# Altium schematic sheet SysController.SchDoc
size 420 x 297 mm; Address1: Address1; Address2: Address2; Address3: Address3; Address4: Address4; DocumentNumber: 5; SheetNumber: 5; SheetTotal: 7; Scale: 1:1; Обозначение документа: АБВГ.123456.001 Э3; Разраб.: Иванов; Пров.: Петров; Утв.: Сидоров; Наименование организации: ОАО "Ваша фирма"; Перв. применение: АБВГ.123456.000; Наименование изделия 1: Плата; Наименование изделия 2: Схема электрическая; Наименование изделия 3: принципиальная; Нач. отд.: Нач. отд.; Фамилия нач. отд.: Сидоров
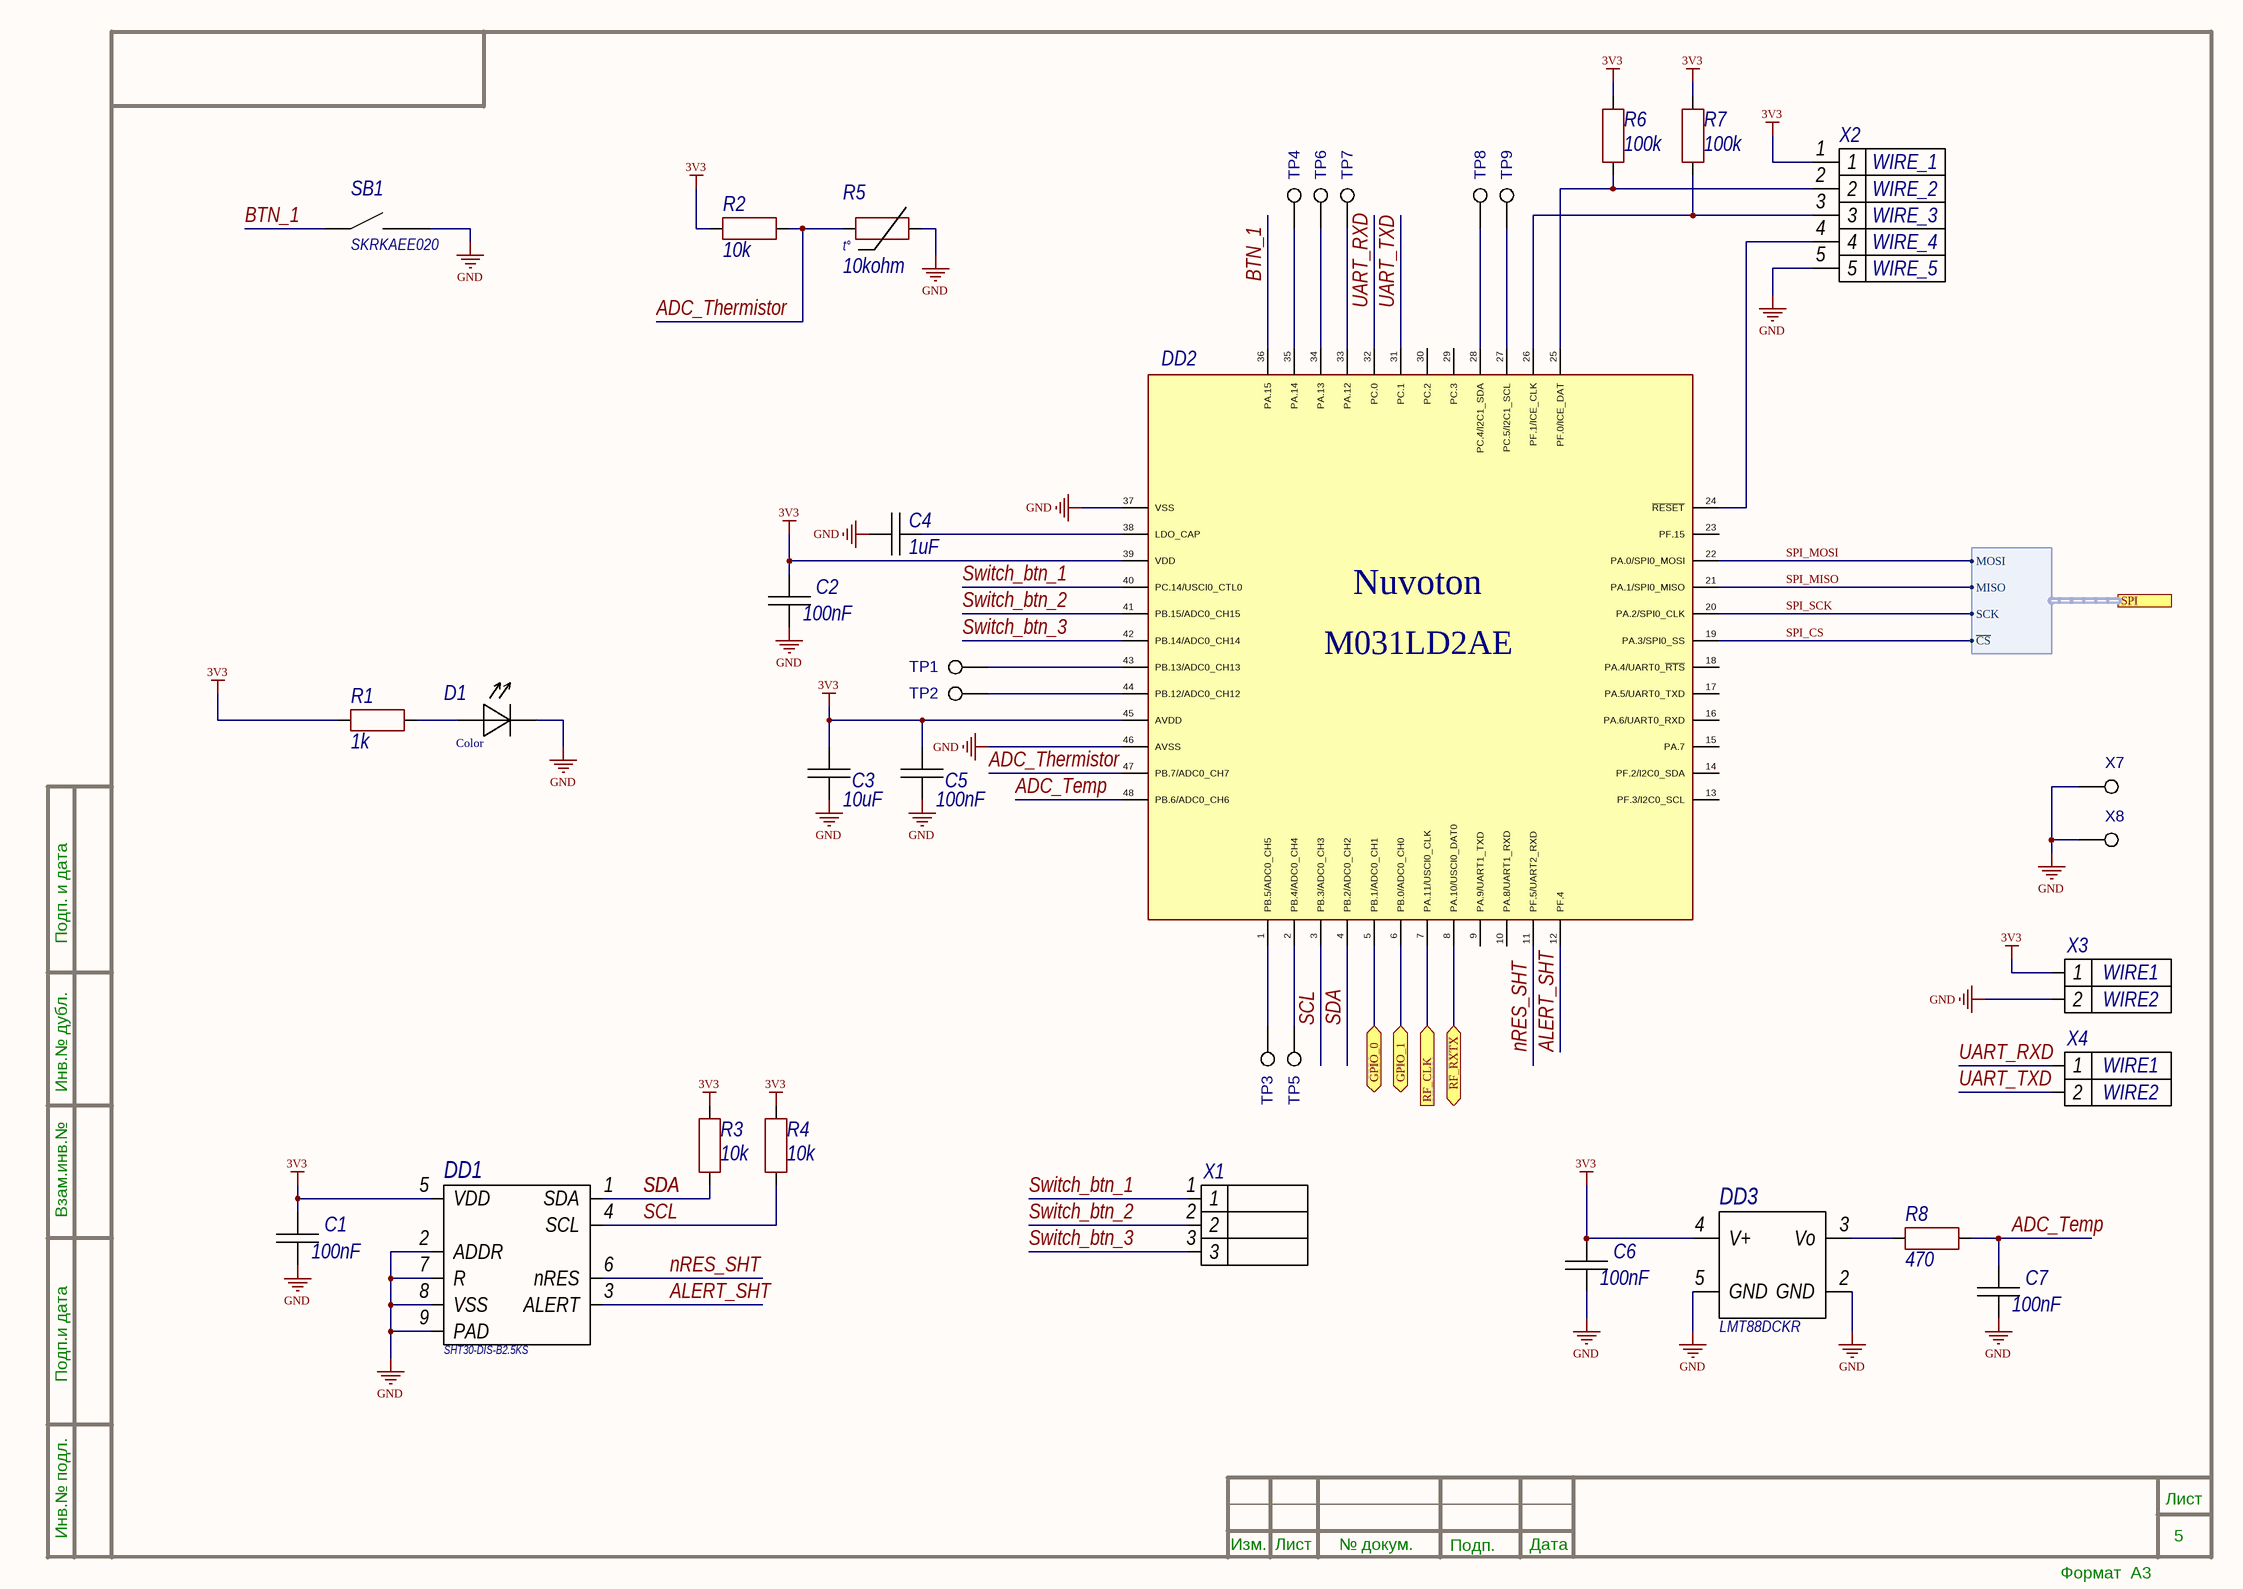
[diagram p0: SysController.SchDoc]

## Parts
C1  100nF  [CAP0402]
C2  100nF  [CAP0402]
C3  10uF  [CAPC0603N]
C4  1uF  [CAPC0603N]
C5  100nF  [CAP0402]
C6  100nF  [CAP0402]
C7  100nF  [CAP0402]
D1  Color  [LED603]
DD1  SHT30-DIS-B2.5KS  [DFN8]
DD2  (no value)  [LQFP48]
DD3  MPN: LMT88DCKR  [SC70-5]
R1  1k  [RESC0402(1005)_M]
R2  10k  [RESC0402(1005)_M]
R3  10k  [RESC0402(1005)_M]
R4  10k  [RESC0402(1005)_M]
R5  value 10kohm  [RESC0805L]
R6  100k  [RESC0402(1005)_M]
R7  100k  [RESC0402(1005)_M]
R8  470  [RESC0402(1005)_M]
SB1  MPN: SKRKAEE020  [SW_SKRKAEE020]  (hidden comment: DTSM-3)
TP1  TP-SINGLE-ROUND  [TP-ROUND-TOP-1.5]  (value not drawn)
TP2  TP-SINGLE-ROUND  [TP-ROUND-TOP-1.5]  (value not drawn)
TP3  TP-SINGLE-ROUND  [TP-ROUND-TOP-1.5]  (value not drawn)
TP4  TP-SINGLE-ROUND  [TP-ROUND-TOP-1.5]  (value not drawn)
TP5  TP-SINGLE-ROUND  [TP-ROUND-TOP-1.5]  (value not drawn)
TP6  TP-SINGLE-ROUND  [TP-ROUND-TOP-1.5]  (value not drawn)
TP7  TP-SINGLE-ROUND  [TP-ROUND-TOP-1.5]  (value not drawn)
TP8  TP-SINGLE-ROUND  [TP-ROUND-TOP-1.5]  (value not drawn)
TP9  TP-SINGLE-ROUND  [TP-ROUND-TOP-1.5]  (value not drawn)
X1  PLS-3  [SmartHome_for_switch]  (value not drawn)
X2  Wire5: WIRE_5  Wire4: WIRE_4  Wire3: WIRE_3  Wire2: WIRE_2  Wire1: WIRE_1  [PLS5]  (hidden comment: PLS5)
X3  DG350-3.5-02P-14-00A  [Conn_3,5mm_2pin]  (value not drawn)
X4  DG350-3.5-02P-14-00A  [Conn_3,5mm_2pin]  (value not drawn)
X7  PLS1  [PLS1]  (value not drawn)  (no BOM)
X8  PLS1  [PLS1]  (value not drawn)  (no BOM)

## Ports
GPIO_0 (bidir), GPIO_1 (bidir), RF_CLK (in), RF_RXTX (bidir), SPI (harness SPI)

## Harnesses
SPI: SCK, MOSI, MISO, ~{CS}

## Nets
3V3: C1.2 C2.2 C3.1 C5.2 C6.2 DD1.5(VDD) DD2.39(VDD) DD2.45(AVDD) DD3.4(V+) R1.1 R2.1 R3.2 R4.2 R6.2 R7.2 X2.1 X3.1
GND: C1.1 C2.1 C3.2 C4.1 C5.1 C6.1 C7.1 D1.1(A) DD1.2(ADDR) DD1.7(R) DD1.8(VSS) DD1.9(PAD) DD2.37(VSS) DD2.46(AVSS) DD3.2(GND) DD3.5(GND) R5.2 SB1.1 X2.5 X3.2 X7.1 X8.1
ADC_Temp: C7.2 DD2.48(PB.6/ADC0_CH6) R8.2
ADC_Thermistor: DD2.47(PB.7/ADC0_CH7) R2.2 R5.1
ALERT_SHT: DD1.3(ALERT) DD2.12(PF.4)
BTN_1: DD2.36(PA.15) SB1.2
GPIO_0: DD2.5(PB.1/ADC0_CH1) ; port GPIO_0
GPIO_1: DD2.6(PB.0/ADC0_CH0) ; port GPIO_1
nRES_SHT: DD1.6(nRES) DD2.11(PF.5/UART2_RXD)
RF_CLK: DD2.7(PA.11/USCI0_CLK) ; port RF_CLK
RF_RXTX: DD2.8(PA.10/USCI0_DAT0) ; port RF_RXTX
SCL: DD1.4(SCL) DD2.3(PB.3/ADC0_CH3) R4.1
SDA: DD1.1(SDA) DD2.4(PB.2/ADC0_CH2) R3.1
SPI_CS: DD2.19(PA.3/SPI0_SS) ; port SPI.~{CS}
SPI_MISO: DD2.21(PA.1/SPI0_MISO) ; port SPI.MISO
SPI_MOSI: DD2.22(PA.0/SPI0_MOSI) ; port SPI.MOSI
SPI_SCK: DD2.20(PA.2/SPI0_CLK) ; port SPI.SCK
Switch_btn_1: DD2.40(PC.14/USCI0_CTL0) X1.1
Switch_btn_2: DD2.41(PB.15/ADC0_CH15) X1.2
Switch_btn_3: DD2.42(PB.14/ADC0_CH14) X1.3
UART_RXD: DD2.32(PC.0) X4.1
UART_TXD: DD2.31(PC.1) X4.2
NetC4_2: C4.2 DD2.38(LDO_CAP)
NetD1_2: D1.2(K) R1.2
NetDD2_1: DD2.1(PB.5/ADC0_CH5) TP3.1
NetDD2_2: DD2.2(PB.4/ADC0_CH4) TP5.1
NetDD2_24: DD2.24(~{RESET}) X2.4
NetDD2_25: DD2.25(PF.0/ICE_DAT) R6.1 X2.2
NetDD2_26: DD2.26(PF.1/ICE_CLK) R7.1 X2.3
NetDD2_27: DD2.27(PC.5/I2C1_SCL) TP9.1
NetDD2_28: DD2.28(PC.4/I2C1_SDA) TP8.1
NetDD2_33: DD2.33(PA.12) TP7.1
NetDD2_34: DD2.34(PA.13) TP6.1
NetDD2_35: DD2.35(PA.14) TP4.1
NetDD2_43: DD2.43(PB.13/ADC0_CH13) TP1.1
NetDD2_44: DD2.44(PB.12/ADC0_CH12) TP2.1
NetDD3_3: DD3.3(Vo) R8.1

Not connected (* = marked no-connect by the designer): DD2 9(PA.9/UART1_TXD) 10(PA.8/UART1_RXD) 13(PF.3/I2C0_SCL) 14(PF.2/I2C0_SDA) 15(PA.7) 16(PA.6/UART0_RXD) 17(PA.5/UART0_TXD) 18(PA.4/UART0_~{RTS}) 23(PF.15) 29(PC.3) 30(PC.2)

## Notes on the sheet
- Подп. и дата
- Инв.№ дубл.
- Взам.инв.№
- Подп.и дата
- Инв.№ подл.
- Изм.
- Лист
- № докум.
- Подп.
- Дата
- Формат  A3
- (in symbol SDNT2012X103F3950FTF) t°

## Library data of the parts
C1 C2 C5-C7 = CAP0402: MntType: SMD; BOMDescription: SMD CHIP CERAMIC CAPACITOR C_0402 100nF; MSL: MSL 1; Package: C_0402; RoHS: Comply; PartType: CHIP CERAMIC CAPACITOR; Pins: 2; CFootprint: =Footprint; Value: 100nF; Part Number: CAP0402; ClassName: Capacitor; ComponentLink1Description: Datasheet
C3 C4 = CAPC: MntType: SMD; MSL: MSL 1; Package: =Footprint; RoHS: Comply; PartType: CHIP CERAMIC CAPACITOR; Pins: 2; BOMDescription: =MntType+' '+PartType+' '+Package+' '+Value+' '+Tolerance+' '+Voltage+' '+TempCoeff+' '+MPN; CFootprint: =Footprint; Part Number: CAPC; ClassName: Capacitor; ComponentLink1Description: Datasheet
  C3: Value: 10uF
  C4: Value: 1uF
D1 = LEDC: MntType: SMD; MSL: MSL 5; Package: LED603; RoHS: Comply; PartType: CHIP LED; Pins: 2; BOMDescription: =MntType+' '+PartType+' '+Package+' '+Value+' '+Tolerance+' '+Voltage+' '+TempCoeff+' '+MPN; CFootprint: LED603; Value: Color; Part Number: LEDC; ClassName: LED; ComponentLink1Description: Datasheet
DD1 = SHT30-DIS-B2.5KS: Manufacturer: SENSIRION; MntType: SMD; MPN: SHT30-DIS-B2.5KS; Part Number: SHT30-DIS-B2.5KS; MSL: MSL 1; Package: DFN8; RoHS: Comply; PartType: Sensor temp and humidity; Pins: 9; BOMDescription: SHT30-DIS-B2.5KS; CFootprint: =Footprint; ClassName: Sensor; ComponentLink1Description: Datasheet; ComponentLink1URL: https://datasheet.lcsc.com/lcsc/2012111104_Sensirion-SHT30-DIS-B2-5KS_C77361.pdf
DD2 = M031LD2AE: Manufacturer: Nuvoton; MntType: SMD; Part Number: M031LD2AE; MPN: M031LD2AE; MSL: MSL 1; Package: LQFP48; RoHS: Comply; PartType: MCU; Pins: 48; BOMDescription: M031LD2AE; CFootprint: =Footprint; ClassName: MCU; ComponentLink1Description: Datasheet; ComponentLink1URL: https://www.nuvoton.com/products/microcontrollers/arm-cortex-m0-mcus/m031-series/m031ld2ae/?group=Document&tab=2
DD3 = LMT88DCKR: Manufacturer: TI; MntType: SMD; Part Number: LMT88DCKR; MSL: MSL 1; Package: SC70; RoHS: Comply; PartType: Temperature sensor; Pins: 5; BOMDescription: LMT88DCKR; CFootprint: =Footprint; ClassName: Temperature sensor; ComponentLink1Description: Datasheet; ComponentLink1URL: https://www.ti.com/lit/ds/symlink/lmt88.pdf?ts=1635229688804&ref_url=https%253A%252F%252Fwww.ti.com%252Fproduct%252FLMT88%253Fqgpn%253Dlmt88
R1-R4 R6-R8 = RES0402: MntType: SMD; MSL: MSL 1; Package: =Footprint; RoHS: Comply; PartType: CHIP RESISTOR; Pins: 2; BOMDescription: =MntType+' '+PartType+' '+Package+' '+Value+' '+Tolerance+' '+Voltage+' '+TempCoeff+' '+MPN; CFootprint: =Footprint; Part Number: RES0402; ClassName: Resistor; ComponentLink1Description: Datasheet
  R1: Value: 1k
  R2-R4: Value: 10k
  R6 R7: Value: 100k
  R8: Value: 470
R5 = SDNT2012X103F3950FTF: Manufacturer: Sunlord; MntType: SMD; Part Number: SDNT2012X103F3950FTF; MPN: SDNT2012X103F3950FTF; MSL: MSL 1; Package: =Footprint; RoHS: Comply; PartType: Thermistor; Pins: 2; BOMDescription: SDNT2012X103F3950FTF; CFootprint: =Footprint; ClassName: Thermistor; ComponentLink1Description: Datasheet; ComponentLink1URL: https://datasheet.lcsc.com/lcsc/1811111111_Sunlord-SDNT2012X103F3950FTF_C95968.pdf
SB1 = SKRKAEE020: MntType: SMD; Part Number: SKRKAEE020; MSL: MSL 1; RoHS: Comply; PartType: BUTTON; Pins: 2; BOMDescription: SKRKAEE020; CFootprint: =Footprint; ClassName: Button; ComponentLink1Description: Datasheet; ComponentLink1URL: https://datasheet.lcsc.com/lcsc/1809201020_ALPSALPINE-SKRKAEE020_C115357.pdf
TP1-TP9 = TP-SINGLE-ROUND: MntType: SMD; MSL: MSL 1; RoHS: Comply; BOMDescription: SMD; CFootprint: =Footprint; Part Number: TP-SINGLE-ROUND; ClassName: Touch; ComponentLink1Description: Datasheet
X1 = SmartHome_for_switch: MntType: DIP; Part Number: SmartHome_for_switch; Value: PLS-3; MPN: PLS-3; MSL: MSL 1; RoHS: Comply; PartType: CONNECTOR; Pins: 3; BOMDescription: PLS-3; CFootprint: =Footprint; ClassName: Connector
X2 = PLS5: MntType: DIP; BOMDescription: DIP CONNECTOR CONNPLS5     PLS5; System: Connector; MPN: PLS5; MSL: MSL 1; Package: CONNPLS5; RoHS: Comply; PartType: CONNECTOR; Pins: 5; CFootprint: PLS5; Part Number: PLS5; ClassName: Connector; ComponentLink1Description: Datasheet
X3 X4 = DG350-3.5-02P-14-00A: MntType: DIP; System: Connector; Wire2: WIRE2; Wire1: WIRE1; Part Number: DG350-3.5-02P-14-00A; MPN: DG350-3.5-02P-14-00A; MSL: MSL 1; RoHS: Comply; PartType: CONNECTOR; Pins: 2; BOMDescription: DG350-3.5-02P-14-00A; CFootprint: =Footprint; ClassName: Connector; ComponentLink1Description: Datasheet; ComponentLink1URL: https://datasheet.lcsc.com/lcsc/2106062140_DEGSON-DG350-3.5-02P-14-00A-H_C2760668.pdf
X7 X8 = Test_PLS1: MntType: DIP; BOMDescription: DIP PLS; System: Connector; MSL: MSL 1; RoHS: Comply; PartType: PLS; Pins: 1; CFootprint: =Footprint; Part Number: Test_PLS1; ClassName: Test_Point; ComponentLink1Description: Datasheet